# Altium schematic sheet TIDA-010056_Page1.SchDoc (part 1 of 2)
size 431 x 279 mm; Date: Not shown in title block; ApprovedBy: Not shown in title block; CheckedBy: Not shown in title block; Author: Not shown in title block; CompanyName: Not shown in title block; DrawnBy: Manu; Engineer: Not shown in title block; Organization: Not shown in title block; Address1: Not shown in title block; Address2: Not shown in title block; Address3: Not shown in title block; Address4: Not shown in title block; DocumentNumber: 1; Revision: Use project parameter SCH_Rev; SheetNumber: 2; SheetTotal: 5; PageSetup: Record=PageOptions|CenterHorizontal=True|CenterVertical=True|PrintScale=1.00|XCorrection=1.00|YCorrection=1.00|PrintKind=0|BorderSize=5000000|LeftOffset=0|BottomOffset=0|Orientation=2|PaperLength=1000|PaperWidth=1000|Scale=100|PaperSource=15|PrintQuality=600|MediaType=1|DitherType=10|PaperKind=Letter|PrintScaleMode=1; CurrentTime: Not shown in title block; CurrentDate: Not shown in title block; Time: Not shown in title block; DocumentFullPathAndName: Not shown in title block; DocumentName: Not shown in title block; ModifiedDate: Not shown in title block; ImagePath: Not shown in title block
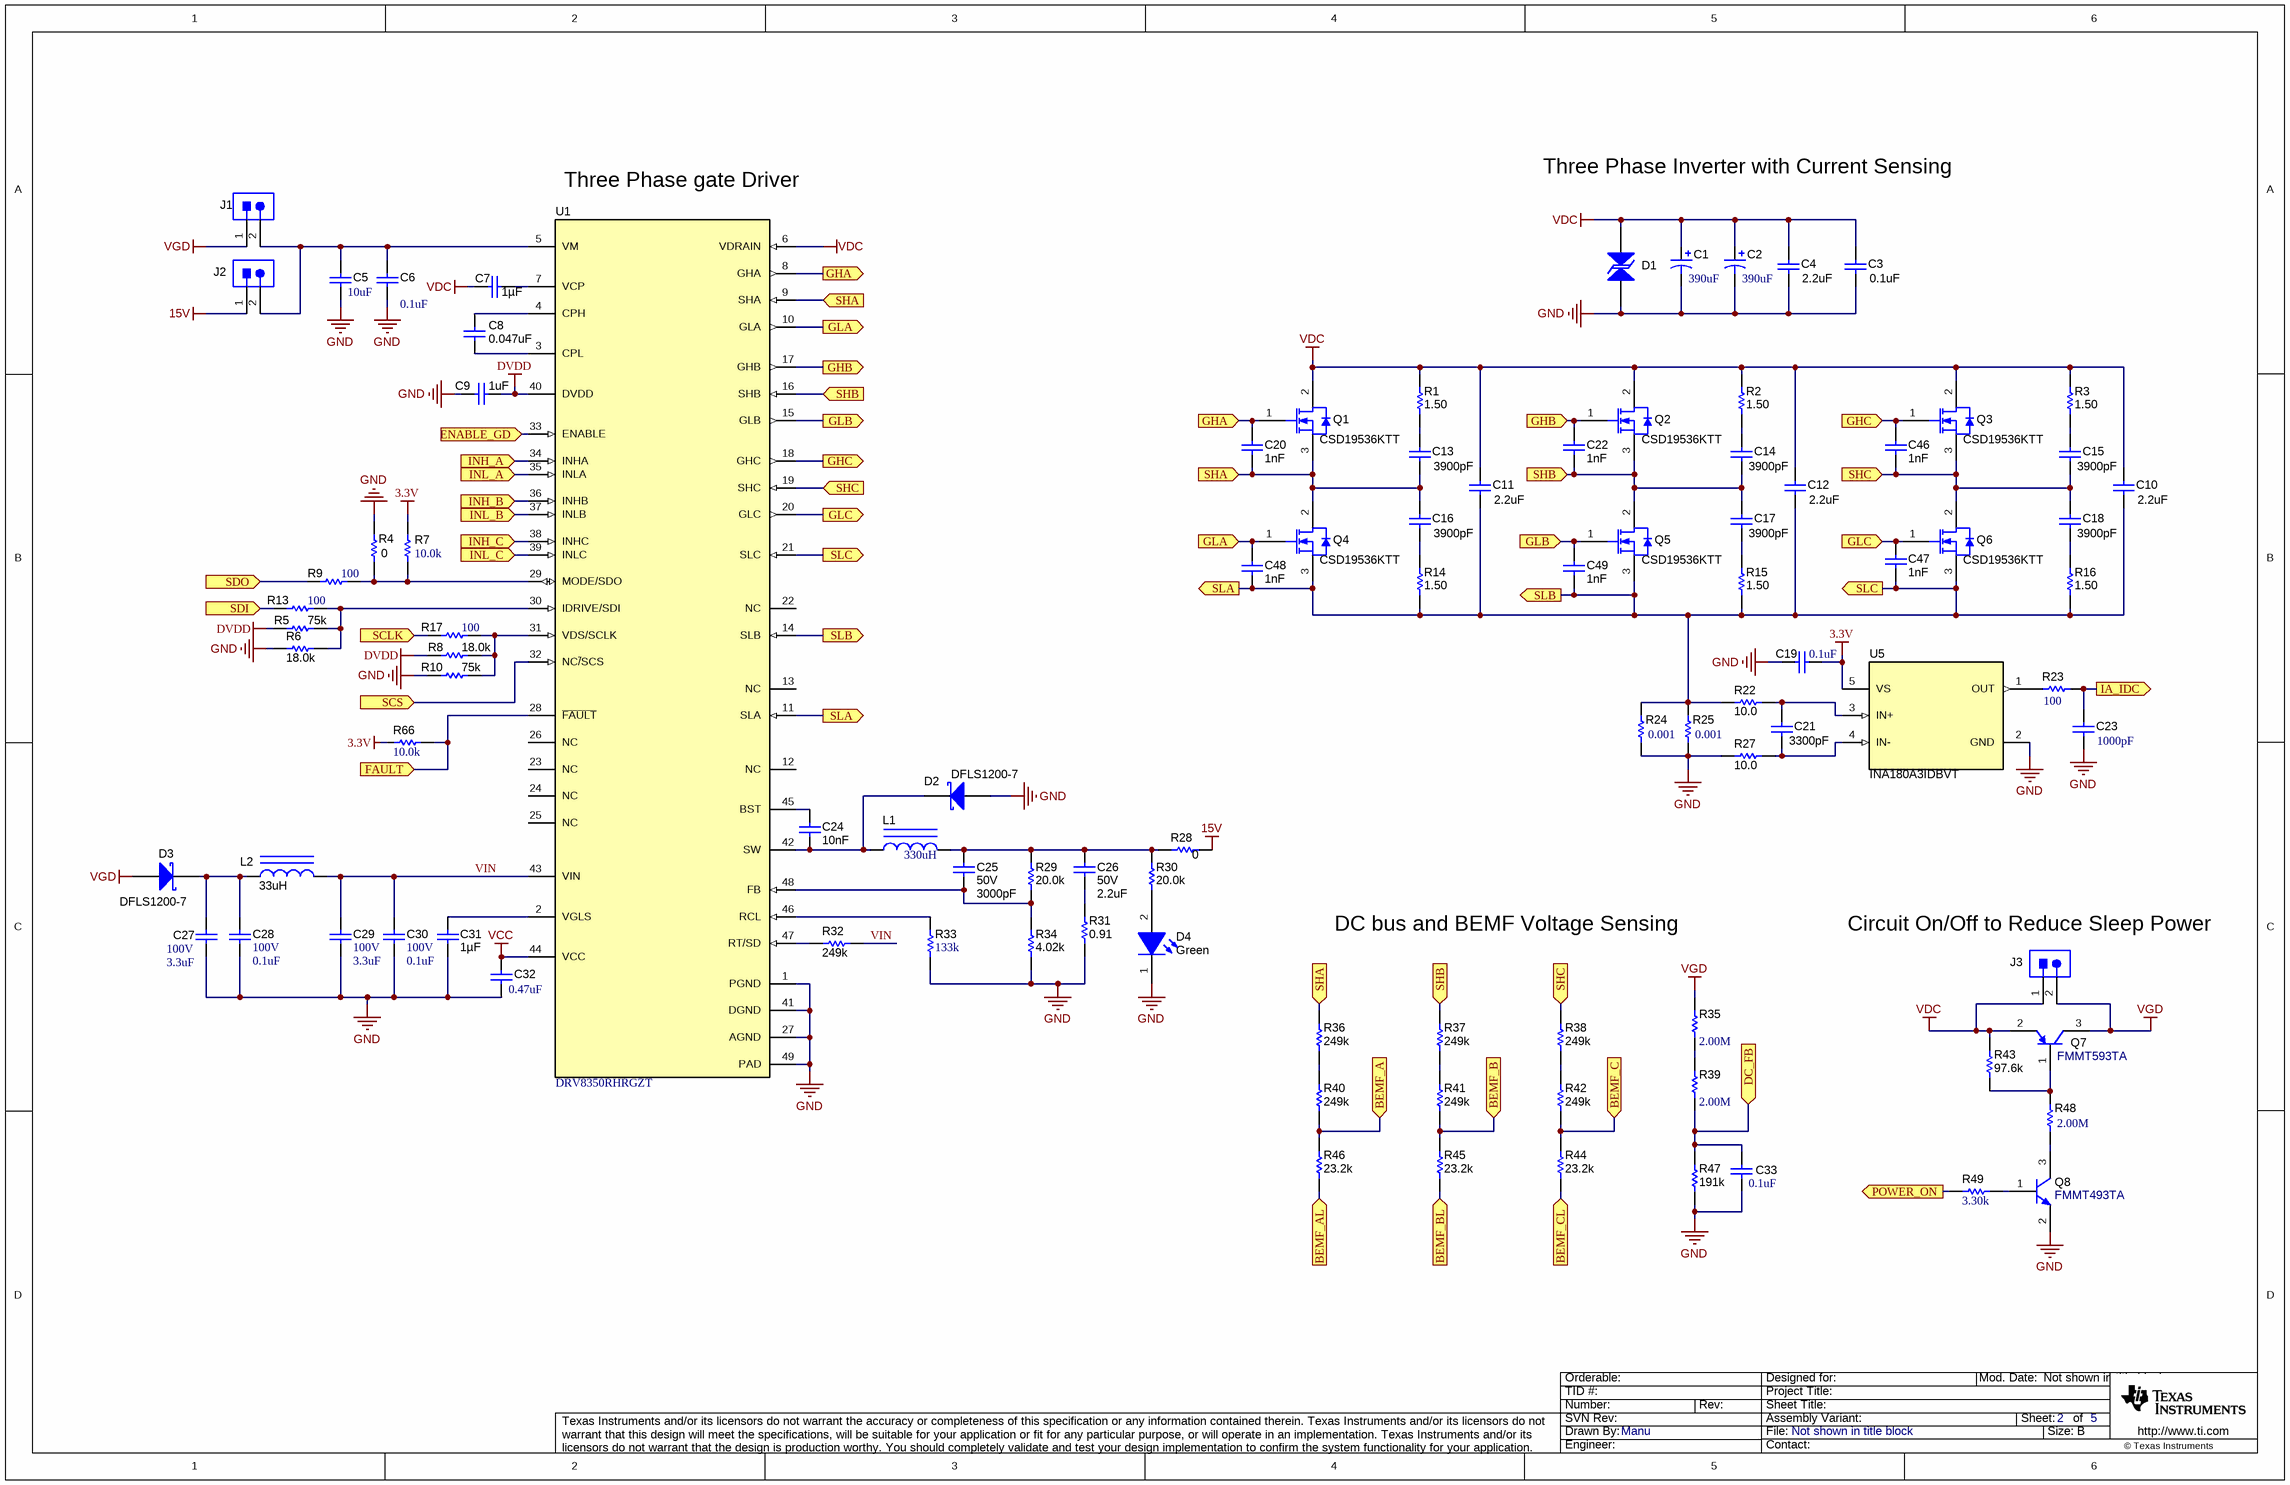
[diagram p0: TIDA-010056_Page1.SchDoc]

## Parts
C1  ValueDisplayed: 390uF  [YXJ_1600x2500]  (hidden comment: EEU-FS2A391)
C2  ValueDisplayed: 390uF  [YXJ_1600x2500]  (hidden comment: EEU-FS2A391)
C3  ValueDisplayed: 0.1uF  [1206_180]  (hidden comment: C3216X7R2A104K160AA)
C4  ValueDisplayed: 2.2uF  [1206]  (hidden comment: CL31B225KCHSNNE)
C5  ValueDisplayed: 10uF  [2220_280]  (hidden comment: 22201C106MAT2A)
C6  ValueDisplayed: 0.1uF  [0603]  (hidden comment: GRM188R72A104KA35D)
C7  ValueDisplayed: 1µF  [0402]  (hidden comment: CL05A105MO5NNNC)
C8  ValueDisplayed: 0.047uF  [0805_HV]  (hidden comment: GRM21BR72A473KA01L)
C9  ValueDisplayed: 1uF  [0402]  (hidden comment: GRM152R60J105ME15D)
C10  ValueDisplayed: 2.2uF  [1206]  (hidden comment: CL31B225KCHSNNE)
C11  ValueDisplayed: 2.2uF  [1206]  (hidden comment: CL31B225KCHSNNE)
C12  ValueDisplayed: 2.2uF  [1206]  (hidden comment: CL31B225KCHSNNE)
C13  ValueDisplayed: 3900pF  [1206]  (hidden comment: 12061C392KAZ2A)
C14  ValueDisplayed: 3900pF  [1206]  (hidden comment: 12061C392KAZ2A)
C15  ValueDisplayed: 3900pF  [1206]  (hidden comment: 12061C392KAZ2A)
C16  ValueDisplayed: 3900pF  [1206]  (hidden comment: 12061C392KAZ2A)
C17  ValueDisplayed: 3900pF  [1206]  (hidden comment: 12061C392KAZ2A)
C18  ValueDisplayed: 3900pF  [1206]  (hidden comment: 12061C392KAZ2A)
C19  ValueDisplayed: 0.1uF  [0402]  (hidden comment: GCM155R71A104KA55D)
C20  Cap_F: 1nF  [0603]  (hidden comment: 885012206083)
C21  ValueDisplayed: 3300pF  [0402]  (hidden comment: GRM155R71H332KA01D)
C22  Cap_F: 1nF  [0603]  (hidden comment: 885012206083)
C23  ValueDisplayed: 1000pF  [0402]  (hidden comment: GRM155R71C102KA01D)
C24  Cap_F: 10nF  [0603]  (hidden comment: 885012206114)
C25  VDC_V: 50V  ValueDisplayed: 3000pF  [0603]  (hidden comment: GRM1885C1H302JA01D)
C26  VDC_V: 50V  ValueDisplayed: 2.2uF  [0805_HV]  (hidden comment: C2012X7R1H225K125AC)
C27  VDC_V: 100V  ValueDisplayed: 3.3uF  [1206_190]  (hidden comment: C3216X7S2A335M160AB)
C28  VDC_V: 100V  ValueDisplayed: 0.1uF  [0603]  (hidden comment: GRM188R72A104KA35D)
C29  VDC_V: 100V  ValueDisplayed: 3.3uF  [1206_190]  (hidden comment: C3216X7S2A335M160AB)
C30  VDC_V: 100V  ValueDisplayed: 0.1uF  [0603]  (hidden comment: GRM188R72A104KA35D)
C31  ValueDisplayed: 1µF  [0402]  (hidden comment: CL05A105MO5NNNC)
C32  ValueDisplayed: 0.47uF  [0402]  (hidden comment: CGB2A1X5R1C474K033BC)
C33  ValueDisplayed: 0.1uF  [0402]  (hidden comment: GCM155R71A104KA55D)
C46  Cap_F: 1nF  [0603]  (hidden comment: 885012206083)
C47  Cap_F: 1nF  [0603]  (hidden comment: 885012206083)
C48  Cap_F: 1nF  [0603]  (hidden comment: 885012206083)
C49  Cap_F: 1nF  [0603]  (hidden comment: 885012206083)
D1  SMBJ70CA-13-F  [SMB-Bi]  (value not drawn)
D2  DFLS1200-7  [PowerDI123]
D3  DFLS1200-7  [PowerDI123]
D4  value Green  [WL-SMCW_GREEN]  (hidden comment: LED_A2_K1)
J1  61300211121  [WURTH_61300211121]  (value not drawn)
J2  61300211121  [WURTH_61300211121]  (value not drawn)
J3  61300211121  [WURTH_61300211121]  (value not drawn)
L1  ValueDisplayed: 330uH  [SDR0604]  (hidden comment: SDR0604-331KL)
L2  ValueDisplayed: 33uH  [NLCV25]  (hidden comment: Inductor_Iron)
Q1  CSD19536KTT  [KTT0002A]
Q2  CSD19536KTT  [KTT0002A]
Q3  CSD19536KTT  [KTT0002A]
Q4  CSD19536KTT  [KTT0002A]
Q5  CSD19536KTT  [KTT0002A]
Q6  CSD19536KTT  [KTT0002A]
Q7  FMMT593TA  [SOT-23]
Q8  FMMT493TA  [SOT-23]
R1  ValueDisplayed: 1.50  [1206]  (hidden comment: CRCW12061R50FKEA)
R2  ValueDisplayed: 1.50  [1206]  (hidden comment: CRCW12061R50FKEA)
R3  ValueDisplayed: 1.50  [1206]  (hidden comment: CRCW12061R50FKEA)
R4  ValueDisplayed: 0  [0402]  (hidden comment: RC0402JR-070RL)
R5  ValueDisplayed: 75k  [0402]  (hidden comment: CRCW040275K0JNED)
R6  ValueDisplayed: 18.0k  [0402]  (hidden comment: ERJ-2RKF1802X)
R7  ValueDisplayed: 10.0k  [0402]  (hidden comment: ERJ-2RKF1002X)
R8  ValueDisplayed: 18.0k  [0402]  (hidden comment: ERJ-2RKF1802X)
R9  ValueDisplayed: 100  [0402]  (hidden comment: ERJ-2GEJ101X)
R10  ValueDisplayed: 75k  [0402]  (hidden comment: CRCW040275K0JNED)
R13  ValueDisplayed: 100  [0402]  (hidden comment: ERJ-2GEJ101X)
R14  ValueDisplayed: 1.50  [1206]  (hidden comment: CRCW12061R50FKEA)
R15  ValueDisplayed: 1.50  [1206]  (hidden comment: CRCW12061R50FKEA)
R16  ValueDisplayed: 1.50  [1206]  (hidden comment: CRCW12061R50FKEA)
R17  ValueDisplayed: 100  [0402]  (hidden comment: ERJ-2GEJ101X)
R22  ValueDisplayed: 10.0  [0402]  (hidden comment: CRCW040210R0FKED)
R23  ValueDisplayed: 100  [0402]  (hidden comment: ERJ-2GEJ101X)
R24  ValueDisplayed: 0.001  [CRE2512-R1_R4]  (hidden comment: CRE2512-FZ-R001E-3)
R25  value 0.001  [CRE2512-R1_R4]  (hidden comment: CRE2512-FZ-R001E-3)
R27  ValueDisplayed: 10.0  [0402]  (hidden comment: CRCW040210R0FKED)
R28  ValueDisplayed: 0  [0402]  (hidden comment: RC0402JR-070RL)
R29  ValueDisplayed: 20.0k  [0402]  (hidden comment: CRCW040220K0FKED)
R30  ValueDisplayed: 20.0k  [0402]  (hidden comment: CRCW040220K0FKED)
R31  ValueDisplayed: 0.91  [0402]  (hidden comment: ERJ-2BQFR91X)
R32  ValueDisplayed: 249k  [0402]  (hidden comment: RC0402FR-07249KL)
R33  ValueDisplayed: 133k  [0402]  (hidden comment: AC0402FR-07133KL)
R34  ValueDisplayed: 4.02k  [0402]  (hidden comment: RC0402FR-074K02L)
R35  ValueDisplayed: 2.00M  [0402]  (hidden comment: CRCW04022M00FKED)
R36  ValueDisplayed: 249k  [0402]  (hidden comment: RC0402FR-07249KL)
R37  ValueDisplayed: 249k  [0402]  (hidden comment: RC0402FR-07249KL)
R38  ValueDisplayed: 249k  [0402]  (hidden comment: RC0402FR-07249KL)
R39  ValueDisplayed: 2.00M  [0402]  (hidden comment: CRCW04022M00FKED)
R40  ValueDisplayed: 249k  [0402]  (hidden comment: RC0402FR-07249KL)
R41  ValueDisplayed: 249k  [0402]  (hidden comment: RC0402FR-07249KL)
R42  ValueDisplayed: 249k  [0402]  (hidden comment: RC0402FR-07249KL)
R43  ValueDisplayed: 97.6k  [0402]  (hidden comment: ERJ-2RKF9762X)
R44  ValueDisplayed: 23.2k  [0402]  (hidden comment: RC0402FR-0723K2L)
R45  ValueDisplayed: 23.2k  [0402]  (hidden comment: RC0402FR-0723K2L)
R46  ValueDisplayed: 23.2k  [0402]  (hidden comment: RC0402FR-0723K2L)
R47  ValueDisplayed: 191k  [0402]  (hidden comment: ERJ-2RKF1913X)
R48  ValueDisplayed: 2.00M  [0402]  (hidden comment: CRCW04022M00FKED)
R49  ValueDisplayed: 3.30k  [0402]  (hidden comment: ERJ-2RKF3301X)
R66  ValueDisplayed: 10.0k  [0402]  (hidden comment: ERJ-2RKF1002X)
U1  DRV8350RHRGZT  [RGZ0048L]
U5  PartNumber: INA180A3IDBVT  [DBV0005A_N]  (hidden comment: INA180A3IDBV)

## Ports
BEMF_A (in), BEMF_AL (in), BEMF_B (in), BEMF_BL (in), BEMF_C (in), BEMF_CL (in), DC_FB (in), ENABLE_GD (in), FAULT (in), GHA (in), GHA (out), GHB (in), GHB (out), GHC (in), GHC (out), GLA (in), GLA (out), GLB (in), GLB (out), GLC (in), GLC (out), IA_IDC (out), INH_A (in), INH_B (in), INH_C (in), INL_A (in), INL_B (in), INL_C (in), POWER_ON (out), SCLK (in), SCS (in), SDI (in), SDO (in), SHA (in), SHB (in), SHC (in), SLA (out), SLB (out), SLC (out)

## Nets
3.3V: C19.2 R7.2 R66.2 U5.5(VS)
15V: J2.1 R28.2
DVDD: C9.1 R5.1 R8.1 U1.40(DVDD)
GND: C1.2(-) C2.2(-) C3.2 C4.2 C5.2 C6.2 C9.2 C19.1 C23.2 C27.2 C28.2 C29.2 C30.2 C31.2 C32.2 C33.2 D1.1 D2.2(A) D4.1(K) Q8.2(E) R4.2 R6.1 R10.1 R24.1 R25.1 R27.1 R31.1 R33.1 R34.1 R47.1 U1.1(PGND) U1.27(AGND) U1.41(DGND) U1.49(PAD) U5.2(GND)
VCC: C32.1 U1.44(VCC)
VDC: C1.1(+) C2.1(+) C3.1 C4.1 C7.2 C10.1 C11.1 C12.1 D1.2 J3.1 Q1.2(D) Q2.2(D) Q3.2(D) Q7.2(E) R1.2 R2.2 R3.2 R43.2 U1.6(VDRAIN)
VGD: D3.2(A) J1.1 J3.2 Q7.3(C) R35.2
BEMF_A: R40.1 R46.2 ; port BEMF_A
BEMF_AL: R46.1 ; port BEMF_AL
BEMF_B: R41.1 R45.2 ; port BEMF_B
BEMF_BL: R45.1 ; port BEMF_BL
BEMF_C: R42.1 R44.2 ; port BEMF_C
BEMF_CL: R44.1 ; port BEMF_CL
DC_FB: C33.1 R39.1 R47.2 ; port DC_FB
ENABLE_GD: U1.33(ENABLE) ; port ENABLE_GD
FAULT: R66.1 U1.28(~{FAULT}) ; port FAULT
GHA: C20.1 Q1.1(G) U1.8(GHA) ; port GHA
GHB: C22.1 Q2.1(G) U1.17(GHB) ; port GHB
GHC: C46.1 Q3.1(G) U1.18(GHC) ; port GHC
GLA: C48.1 Q4.1(G) U1.10(GLA) ; port GLA
GLB: C49.1 Q5.1(G) U1.15(GLB) ; port GLB
GLC: C47.1 Q6.1(G) U1.20(GLC) ; port GLC
IA_IDC: C23.1 R23.2 ; port IA_IDC
INH_A: U1.34(INHA) ; port INH_A
INH_B: U1.36(INHB) ; port INH_B
INH_C: U1.38(INHC) ; port INH_C
INL_A: U1.35(INLA) ; port INL_A
INL_B: U1.37(INLB) ; port INL_B
INL_C: U1.39(INLC) ; port INL_C
POWER_ON: R49.2 ; port POWER_ON
SCLK: R17.1 ; port SCLK
SCS: U1.32(NC~{/}SCS) ; port SCS
SDI: R13.1 ; port SDI
SDO: R9.1 ; port SDO
SHA: C13.2 C16.1 C20.2 Q1.3(S) Q4.2(D) R36.2 U1.9(SHA) ; port SHA
SHB: C14.2 C17.1 C22.2 Q2.3(S) Q5.2(D) R37.2 U1.16(SHB) ; port SHB
SHC: C15.2 C18.1 C46.2 Q3.3(S) Q6.2(D) R38.2 U1.19(SHC) ; port SHC
SLA: C10.2 C11.2 C12.2 C47.2 C48.2 C49.2 Q4.3(S) Q5.3(S) Q6.3(S) R14.1 R15.1 R16.1 R22.1 R24.2 R25.2 U1.11(SLA) U1.14(SLB) U1.21(SLC) ; port SLC, port SLB, port SLA
VIN: C29.1 C30.1 L2.2 R32.1 U1.43(VIN)
NetC5_1: C5.1 C6.1 J1.2 J2.2 U1.5(VM)
NetC7_1: C7.1 U1.7(VCP)
NetC8_1: C8.1 U1.3(CPL)
NetC8_2: C8.2 U1.4(CPH)
NetC13_1: C13.1 R1.1
NetC14_1: C14.1 R2.1
NetC15_1: C15.1 R3.1
NetC16_2: C16.2 R14.2
NetC17_2: C17.2 R15.2
NetC18_2: C18.2 R16.2
NetC21_1: C21.1 R22.2 U5.3(IN+)
NetC21_2: C21.2 R27.2 U5.4(IN-)
NetC24_1: C24.1 U1.45(BST)
NetC24_2: C24.2 D2.1(K) L1.1 U1.42(SW)
NetC25_1: C25.1 C26.1 L1.2 R28.1 R29.2 R30.2
NetC25_2: C25.2 R29.1 R34.2 U1.48(FB)
NetC26_2: C26.2 R31.2
NetC27_1: C27.1 C28.1 D3.1(K) L2.1
NetC31_1: C31.1 U1.2(VGLS)
NetD4_2: D4.2(A) R30.1
NetQ7_1: Q7.1(B) R43.1 R48.2
NetQ8_1: Q8.1(B) R49.1
NetQ8_3: Q8.3(C) R48.1
NetR4_1: R4.1 R7.1 R9.2 U1.29(MODE/SDO)
NetR5_2: R5.2 R6.2 R13.2 U1.30(IDRIVE/SDI)
NetR8_2: R8.2 R10.2 R17.2 U1.31(VDS/SCLK)
NetR23_1: R23.1 U5.1(OUT)
NetR32_2: R32.2 U1.47(RT/SD)
NetR33_2: R33.2 U1.46(RCL)
NetR35_1: R35.1 R39.2
NetR36_1: R36.1 R40.2
NetR37_1: R37.1 R41.2
NetR38_1: R38.1 R42.2

Not connected (* = marked no-connect by the designer): U1 12(NC) 13(NC) 22(NC) 23(NC) 24(NC) 25(NC) 26(NC)

## Notes on the sheet
- Three Phase Inverter with Current Sensing
- Three Phase gate Driver
- DC bus and BEMF Voltage Sensing
- (near J3) Circuit On/Off to Reduce Sleep Power
- Drawn By:
- SVN Rev:
- Number:
- TID #:
- Orderable:
- Rev:
- Sheet Title:
- File:
- Project Title:
- Designed for:
- Assembly Variant:
- Mod. Date:
- Sheet:
- Size:
- of
- B
- http://www.ti.com
- Texas Instruments and/or its licensors do not warrant the accuracy or completeness of this specification or any information contained therein. Texas Instruments and/or its licensors do not warrant that this design will meet the specifications, will be suitable for your application or fit for any particular purpose, or will operate in an implementation. Texas Instruments and/or its licensors do not warrant that the design is production worthy. You should completely validate and test your design implementation to confirm the system functionality for your application.
- Engineer:
- Contact:
- © Texas Instruments